# EasyEDA schematic Schematic_Arduino-UNO-shield-for-programming-the-AT28C-EEPROM.json
TITLE: Arduino UNO R3 Shield AT26C Programmer; REV: 3.1; Date: 26/04/2024; Sheet: 1/1; Drawn By: Tudor S.; Company: Black Mesa Research Facility
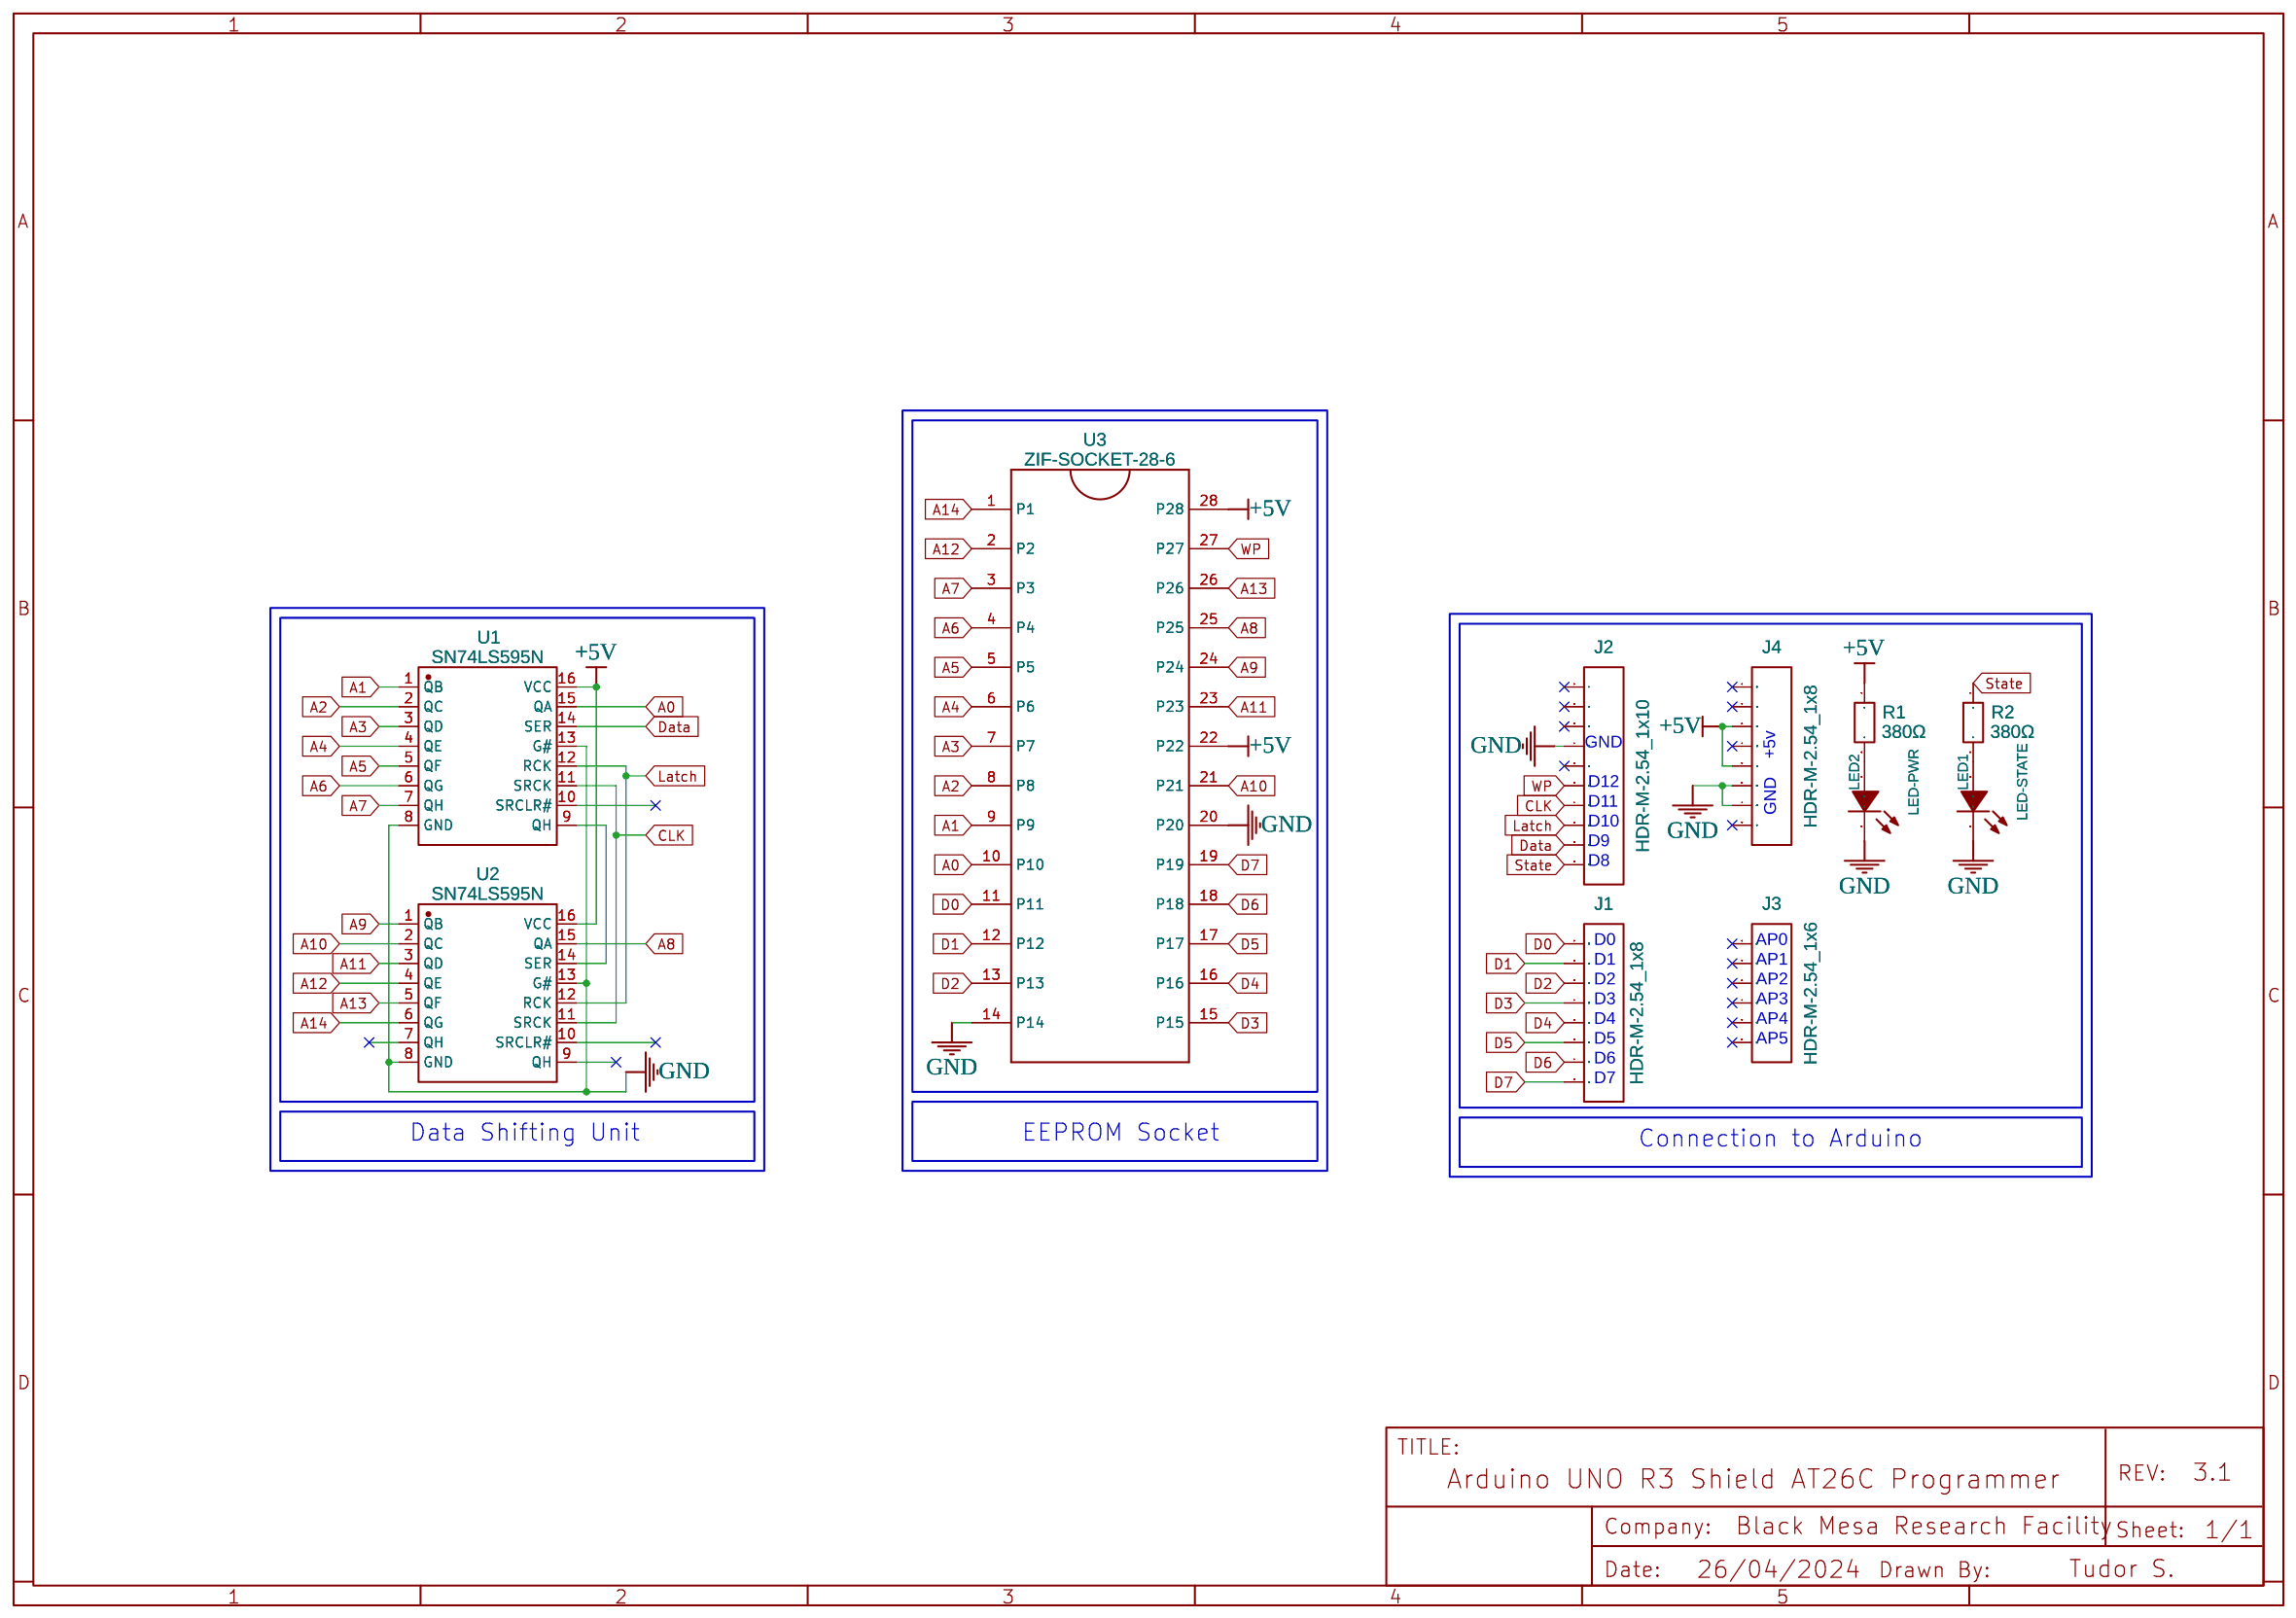
[diagram p0: schematic sheet]

## Parts
J1  HDR-M-2.54_1x8  [HDR-M-2.54_1X8]
J2  HDR-M-2.54_1x10  [HDR-M-2.54_1X10]
J3  HDR-M-2.54_1x6  [HDR-M-2.54_1X6]
J4  HDR-M-2.54_1x8  [HDR-M-2.54_1X8]
LED1  LED-STATE  [LED0603_RED]
LED2  LED-PWR  [LED0603_RED]
R1  380Ω  [C0805]
R2  380Ω  [C0805]
U1  SN74LS595N  [PDIP-16_L19.3-W6.5-P2.54-LS7.6-BL]
U2  SN74LS595N  [PDIP-16_L19.3-W6.5-P2.54-LS7.6-BL]
U3  ZIF-SOCKET-28-6  [ZIFSOCKET-28-6_3D]

## Library data of the parts
J1 J4 = HDR-M-2.54_1x8: Supplier Part: C190820; Supplier: LCSC; Contributor: LCEDA_Lib
J2 = HDR-M-2.54_1x10: Supplier Part: C57369; Supplier: LCSC; Contributor: LCEDA_Lib
J3 = HDR-M-2.54_1x6: Supplier Part: C190819; Supplier: LCSC; Contributor: LCEDA_Lib
LED1 LED2 = LED-0603_R: Manufacturer: EVERLIGHT(台湾亿光); Manufacturer Part: 19-217/R6C-AL1M2VY/3T; Supplier Part: C72044; Supplier: LCSC; Contributor: LCEDA_01
R1 R2 = R_AXIAL-0.4_EU: Contributor: LCEDA_Lib
U1 U2 = SN74LS595N: Contributor: LCSC; Supplier: LCSC; Supplier Part: C2865449; Manufacturer: TI(德州仪器); link: https://lcsc.com/eda_search?q=C2865449&%26type=1&ref=editor
U3 = ZIF-SOCKET-28-6: Manufacturer Part: ZIFSOCKET-28-6; Contributor: Grig96

## Nets
+5V: J4.3(RESET) J4.5(+5V) R1.1 U1.16(VCC) U2.16(VCC) U3.22(P22) U3.28(P28)
GND: J2.4(GND) J4.6(GND) J4.7(GND) LED1.2 LED2.2 U1.8(GND) U1.13(G#) U2.8(GND) U2.13(G#) U3.14(P14) U3.20(P20)
A0: U1.15(QA) U3.10(P10)
A1: U1.1(QB) U3.9(P9)
A2: U1.2(QC) U3.8(P8)
A3: U1.3(QD) U3.7(P7)
A4: U1.4(QE) U3.6(P6)
A5: U1.5(QF) U3.5(P5)
A6: U1.6(QG) U3.4(P4)
A7: U1.7(QH) U3.3(P3)
A8: U2.15(QA) U3.25(P25)
A9: U2.1(QB) U3.24(P24)
A10: U2.2(QC) U3.21(P21)
A11: U2.3(QD) U3.23(P23)
A12: U2.4(QE) U3.2(P2)
A13: U2.5(QF) U3.26(P26)
A14: U2.6(QG) U3.1(P1)
CLK: J2.7(D11) U1.11(SRCK) U2.11(SRCK)
D0: J1.1(D0) U3.11(P11)
D1: J1.2(D1) U3.12(P12)
D2: J1.3(D2) U3.13(P13)
D3: J1.4(D3) U3.15(P15)
D4: J1.5(D4) U3.16(P16)
D5: J1.6(D5) U3.17(P17)
D6: J1.7(D6) U3.18(P18)
D7: J1.8(D7) U3.19(P19)
Data: J2.9(D9) U1.14(SER)
Latch: J2.8(D10) U1.12(RCK) U2.12(RCK)
State: J2.10(D8) R2.1
WP: J2.6(D12) U3.27(P27)
Net-(LED1-1): LED1.1 R2.2
Net-(LED2-1): LED2.1 R1.2
Net-(U1-9): U1.9(QH) U2.14(SER)

Not connected (* = marked no-connect by the designer): J2 1* 2* 3(AREF)* 5(D13)*; J3 1(S0)* 2(S1)* 3(S2)* 4(S3)* 5(S4)* 6(S5)*; J4 1(J2)* 2(+5V)* 4(+3.3V)* 8(VIN)*; U1 10(SRCLR#); U2 7(QH) 9(QH) 10(SRCLR#)

## Notes on the sheet
- GND
- +5v
- D12
- D10
- D11
- GND
- D9
- D8
- D0
- D1
- AP0
- AP1
- D2
- AP2
- D3
- AP3
- D4
- AP4
- D5
- AP5
- D6
- D7
- Data Shifting Unit
- EEPROM Socket
- Connection to Arduino
